# Altium schematic sheet AudioMonitor_Schem.SchDoc
size A4; SheetNumber: 1; SheetTotal: 1
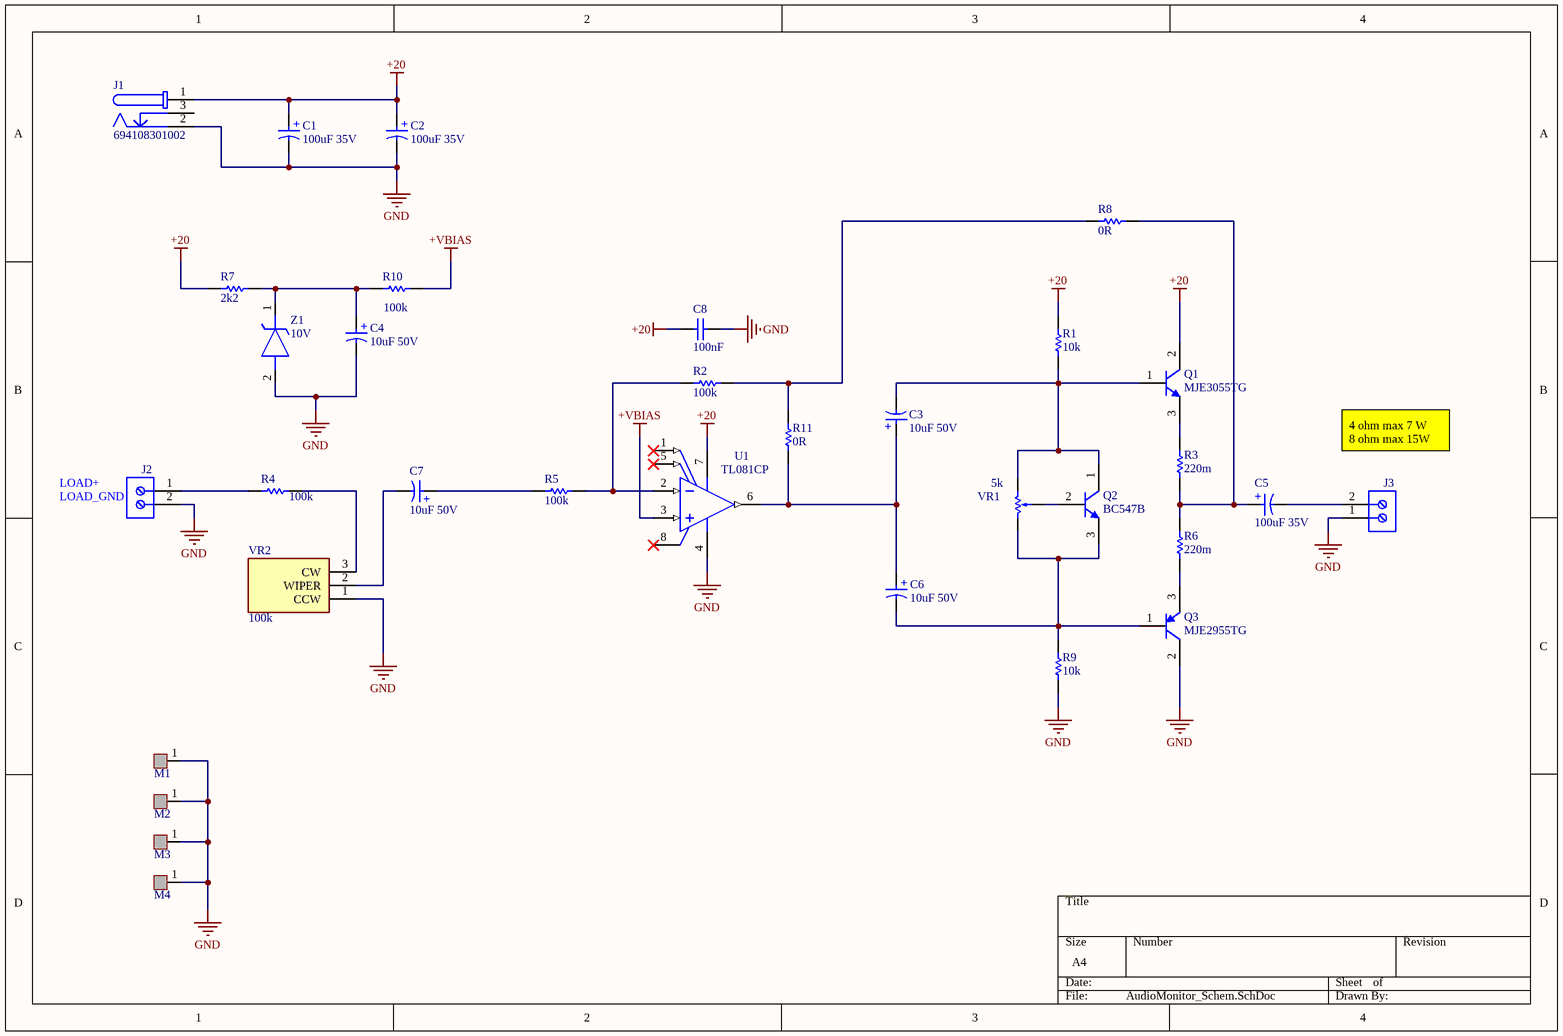
[diagram p0: AudioMonitor_Schem.SchDoc]

## Parts
C1  value 100uF 35V  [Wurth D6.3x7.7mm]  (hidden comment: ROQANG RVT1V101M0607)
C2  value 100uF 35V  [Wurth D6.3x7.7mm]  (hidden comment: ROQANG RVT1V101M0607)
C3  Capacitance: 10uF 50V  [WURTH THT CAP D5H11 P2mm]  (hidden comment: AISHI CE-10/50PHT-Y)
C4  Capacitance: 10uF 50V  [WURTH THT CAP D5H11 P2mm]  (hidden comment: AISHI CE-10/50PHT-Y)
C5  value 100uF 35V  [Wurth D6.3x7.7mm]  (hidden comment: ROQANG RVT1V101M0607)
C6  Capacitance: 10uF 50V  [WURTH THT CAP D5H11 P2mm]  (hidden comment: AISHI CE-10/50PHT-Y)
C7  Capacitance: 10uF 50V  [WURTH THT CAP D5H11 P2mm]  (hidden comment: AISHI CE-10/50PHT-Y)
C8  value 100nF  [Wurth 0603 capacitor]  (hidden comment: Capacitor 100nF 0603 50V)
J1  694108301002  [694108301002]
J2  691101710002  [Wurth 2 pin 5mm screw terminal]  (value not drawn)
J3  691101710002  [Wurth 2 pin 5mm screw terminal]  (value not drawn)
M1  Mounting hole  [M3 hole]  (value not drawn)
M2  Mounting hole  [M3 hole]  (value not drawn)
M3  Mounting hole  [M3 hole]  (value not drawn)
M4  Mounting hole  [M3 hole]  (value not drawn)
Q1  MJE3055TG  [ONSC-TO-220-3-221A-09]
Q2  BC547B  [ONSC-TO-92-3-29-11]
Q3  MJE2955TG  [ONSC-TO-220-3-221A-09]
R1  value 10k  [Wurth 0603 Resistor]  (hidden comment: Resistor 10k 0603)
R2  value 100k  [Wurth 0603 Resistor]  (hidden comment: Resistor 100k 0603)
R3  value 220m  [Viking 2010 Resistor]  (hidden comment: Resistor 220m 2010)
R4  value 100k  [Wurth 0603 Resistor]  (hidden comment: Resistor 100k 0603)
R5  value 100k  [Wurth 0603 Resistor]  (hidden comment: Resistor 100k 0603)
R6  value 220m  [Viking 2010 Resistor]  (hidden comment: Resistor 220m 2010)
R7  value 2k2  [Wurth 0603 Resistor]  (hidden comment: Resistor 2k2 0603)
R8  value 0R  [Wurth 0603 Resistor]  (hidden comment: Resistor 0R 0603)
R9  value 10k  [Wurth 0603 Resistor]  (hidden comment: Resistor 10k 0603)
R10  value 100k  [Wurth 0603 Resistor]  (hidden comment: Resistor 100k 0603)
R11  value 0R  [Wurth 0603 Resistor]  (hidden comment: Resistor 0R 0603)
U1  TL081CP  [P0008A]
VR1  value 5k  [SRpassives RKT6V-5K]  (hidden comment: RKT6V-5K)
VR2  100k  [PDB181K215P503B]
Z1  10V  [BZT52C10TTP]

## Nets
+20: C1.1(P) C2.1(P) C8.1 J1.1 Q1.2(C) R1.2 R7.2 U1.7(VCC+)
+VBIAS: R10.1 U1.3(IN+)
GND: C1.2(N) C2.2(N) C4.2(N) C8.2 J1.2 J2.2 J3.1 M1.1 M2.1 M3.1 M4.1 Q3.2(C) R9.1 U1.4(VCC-) VR2.1(CCW) Z1.2(A)
NetC3_1: C3.1(P) C6.1(P) R11.1 U1.6(OUT)
NetC3_2: C3.2(N) Q1.1(B) Q2.1(C) R1.1 VR1.3
NetC4_1: C4.1(P) R7.1 R10.2 Z1.1(K)
NetC5_1: C5.1(P) R3.1 R6.2 R8.2
NetC5_2: C5.2(N) J3.2
NetC6_2: C6.2(N) Q2.3(E) Q3.1(B) R9.2 VR1.1
NetC7_1: C7.1(P) R5.1
NetC7_2: C7.2(N) VR2.2(WIPER)
NetJ2_1: J2.1 R4.1
NetQ1_3: Q1.3(E) R3.2
NetQ2_2: Q2.2(B) VR1.2
NetQ3_3: Q3.3(E) R6.1
NetR2_1: R2.1 R5.2 U1.2(IN-)
NetR2_2: R2.2 R8.1 R11.2
NetR4_2: R4.2 VR2.3(CW)

Not connected (* = marked no-connect by the designer): J1 3; U1 1(OFFSET_N1)* 5(OFFSET_N2)* 8(NC)*

## Notes on the sheet
- 4 ohm max 7 W
  8 ohm max 15W
- LOAD+
- (near J2) LOAD_GND
- (in symbol 10uF 50V THT) +
- (in symbol 100uF 35V SMD) +

## Library data of the parts
C1 C2 C5 = 100uF 35V SMD: SMD,D6.3xL7.7mm
C3 C4 C6 C7 = 10uF 50V THT: Aluminum Electrolytic Capacitor, Radial, THT, D5 x H11mm, 10uF, 50V; Manufacturer Part Number: 860010672009; Manufacturer: Wurth Elektronik; Match Code: WCAP-ATG8; Capacitance Tolerance: +/-20%; Dissipation Factor: 10%; Endurance: 2000h; Leakage Current: 5uA; Ripple Current: 72mA; Technical Reference: ATBC110100M050DSPA3B000; Category: Aluminum Electrolytic Capacitors; ComponentLink1Description: Website Link; ComponentLink1URL: https://www.we-online.com/redexpert/article/860010672009?ad; ComponentLink2Description: Datasheet Link; ComponentLink2URL: https://www.we-online.com/redexpert/spec/860010672009?ad; Mount: Through Hole; Operating Temperature Max: 85°C; Operating Temperature Min: -40°C; Packaging: Ammo Pack; Height: 11mm; Diameter: 5mm; Rated Voltage (DC): 50V
J1 = CMP-1502-00190-4: DC Power Jack Connector WR-DC, Male, Right Angled, THT, 5 A, 24 V; Operating Supply Voltage: 24V; Shielding: Unshielded; Voltage Rating: 30V; Number of Contacts: 3; Insulation Resistance: 100MΩ; Current Rating: 5A; Min Operating Temperature: -40°C; Packaging: Bulk; Connector Type: Power; Housing Material: Polyamide; REACH SVHC: Unknown; Termination: Through Hole; Contact Gender: Female; Mount: Through Hole; RoHS: Compliant; Flammability Rating: UL94 V-0; Height: 11mm; Max Operating Temperature: 85°C; Contact Plating: Tin; Color: Black; Gender: Male; Contact Material: Gold, Tin
J2 J3 = 2 pin 5mm screw terminal: WR-TBL Series 101 Horizontal Entry Modular, THT, pitch 5mm, 02p; Manufacturer: Wurth Elektronik; Modularity: Yes; Rated Current: 16A; Wire Section: 26 to 14 (AWG) 0.5 to 2.5 (mm^2); Working Voltage: 250V (AC); Manufacturer Part Number: 691101710002; Product Series: WR-TBL; ComponentLink1Description: Website Link; ComponentLink1URL: https://www.we-online.com; ComponentLink2Description: Datasheet Link; ComponentLink2URL: https://www.we-online.com/components/products/datasheet/691101710002; Mount: Through Hole; Operating Temperature Min: -40degC; Operating Temperature Max: 105degC; Packaging: Box; Application: Pressure Clamp; Number of Pins: 2; Number of Rows: 1; Orientation: Horizontal; Lead Pitch: 5mm
Q1 = CMP-1048-00035-1: Complementary Silicon Plastic Power Transistor, 3-Pin TO-220, Pb-Free, Tube; Manufacturer: On Semiconductor; IC Continuous (A): 10; fT Min (MHz): 2; Polarity: NPN; ComponentLink3URL: http://www.onsemi.com/pub_link/Collateral/221A-09.PDF; ComponentLink2URL: http://www.onsemi.com/pub_link/Collateral/MJE2955T-D.PDF; ComponentLink3Description: Package Specification; DatasheetVersion: Rev. 11; PackageVersion: Rev. AG, 09/2011; PartNumber: MJE3055TG; RoHS: TRUE; PackageReference: TO-220-3-221A-09; ComponentLink2Description: Datasheet; Packing: Tube; Mounting Technology: Through Hole; PackageDescription: 3-Pin Flange Mount, Vertical Straight Lead, Body 9.97 x 4.445 mm, Pitch 2.54 mm; ComponentLink1URL: http://www.onsemi.com/; ComponentLink1Description: Manufacturer URL
Q2 = CMP-1048-01467-1: Amplifier Transistor, NPN Silicon, 3-Pin TO-92, Bulk Box; Manufacturer: On Semiconductor; IC Continuous (A): 0.1; fT Min (MHz): 150; DatasheetVersion: Rev. 7; ComponentLink1URL: http://www.onsemi.com/; Polarity: NPN; RoHS: FALSE; ComponentLink1Description: Manufacturer URL; Packing: Bulk Box; PackageDescription: 3-Pin Transistor Outline, Body 4.825 x 3.685 mm, Pitch 1.27 mm; ComponentLink3URL: http://www.onsemi.cn/pub_link/Collateral/2N6426-D.PDF; ComponentLink2Description: Datasheet; PackageVersion: Rev. AM; PackageReference: TO-92-3-29-11_AM_SL; ComponentLink3Description: Package Specification; Mounting Technology: Through Hole; PartNumber: BC547B; ComponentLink2URL: http://www.onsemi.com/pub_link/Collateral/BC546-D.PDF
Q3 = CMP-1048-01153-1: Complementary Silicon Plastic Power Transistor, 3-Pin TO-220, Pb-Free, Tube; Manufacturer: On Semiconductor; IC Continuous (A): 10; fT Min (MHz): 2; Polarity: PNP; DatasheetVersion: Rev. 11; Mounting Technology: Through Hole; ComponentLink3Description: Package Specification; ComponentLink3URL: http://www.onsemi.com/pub_link/Collateral/221A-09.PDF; ComponentLink1Description: Manufacturer URL; Packing: Tube; ComponentLink1URL: http://www.onsemi.com/; RoHS: TRUE; ComponentLink2Description: Datasheet; ComponentLink2URL: http://www.onsemi.com/pub_link/Collateral/MJE2955T-D.PDF; PackageDescription: 3-Pin Flange Mount, Vertical Straight Lead, Body 9.97 x 4.445 mm, Pitch 2.54 mm; PackageVersion: Rev. AG, 09/2011; PartNumber: MJE2955TG; PackageReference: TO-220-3-221A-09
U1 = CMP-0017-00937-2: JFET-Input Operational Amplifier, 7 to 36 V, 0 to 70 degC, 8-pin DIP (P8), Pb-Free (RoHS); Manufacturer: Texas Instruments; Rating: Military; GBW(Typ)(MHz): 3; Vio (25C)(Max)(mV): 15; CMRR(Min)(dB): 70; Slew Rate(Typ)(V/us): 13; IIB(Max)(pA): 400; Vn at 1kHz(Typ)(nV/rtHz): 18; Sub Family: General Purpose Amplifier, High Supply Voltage Amplifier (>=30V); Number of Channels: 1; Total Supply Voltage(Min)(+5V is 5, +/-5V is 10): 7; Total Supply Voltage(Max)(+5V is 5, +/-5V is 10): 36; Iq per channel(Max)(mA): 2.8; Eco-Plan: Pb-Free (RoHS); PackageReference: P0008A; ComponentLink3URL: http://www.ti.com/litv/pdf/mpdi001b; ComponentLink1URL: http://www.ti.com/; Mounting Technology: Through Hole; Code_JEDEC: MS-001; ComponentLink3Description: Package Specification; PartNumber: TL081CP; PackageVersion: 4040082/E, 04/2010; ComponentLink2Description: Datasheet; DatasheetVersion: SLOS081G; PackageDescription: 8-Pin Plastic In-Line, Body 9.59 x 6.35 mm, Pitch 2.54 mm; ComponentLink2URL: http://www.ti.com/lit/ds/symlink/tl081.pdf; Offset Drift(Typ)(uV/C): 18; ComponentLink1Description: Manufacturer URL
VR1 = 5k THT trimmer
VR2 = PDB181-K215P-503B: Variable Resistor; Manufacturer_Name: Bourns; Datasheet Link: https://www.digikey.in/en/products/detail/bourns-inc/PDB181-K215P-503B/4699117; Height: 21mm; Manufacturer_Part_Number: PDB181-K215P-503B; Mouser Part Number: 652-PDB181K215P503B; Mouser Price/Stock: https://www.mouser.co.uk/ProductDetail/Bourns/PDB181-K215P-503B?qs=Zq5ylnUbLm4zTjfFsN3naw%3D%3D
Z1 = BZT52C10T-TP: Zener Diode; Manufacturer_Name: MCC; Datasheet Link: https://www.mccsemi.com/pdf/Products/BZT52C(B)2V4T-BZT52C(B)39T(SOD-523).pdf; Height: 0.65mm; Manufacturer_Part_Number: BZT52C10T-TP; Mouser Part Number: 833-BZT52C10T-TP; Mouser Price/Stock: https://www.mouser.com/Search/Refine.aspx?Keyword=833-BZT52C10T-TP; Arrow Part Number: BZT52C10T-TP; Arrow Price/Stock: https://www.arrow.com/en/products/bzt52c10t-tp_1/micro-commercial-components.html?utm_currency=USD&region=nac